# EAGLE design schematics (EAGLE 7.5.0)
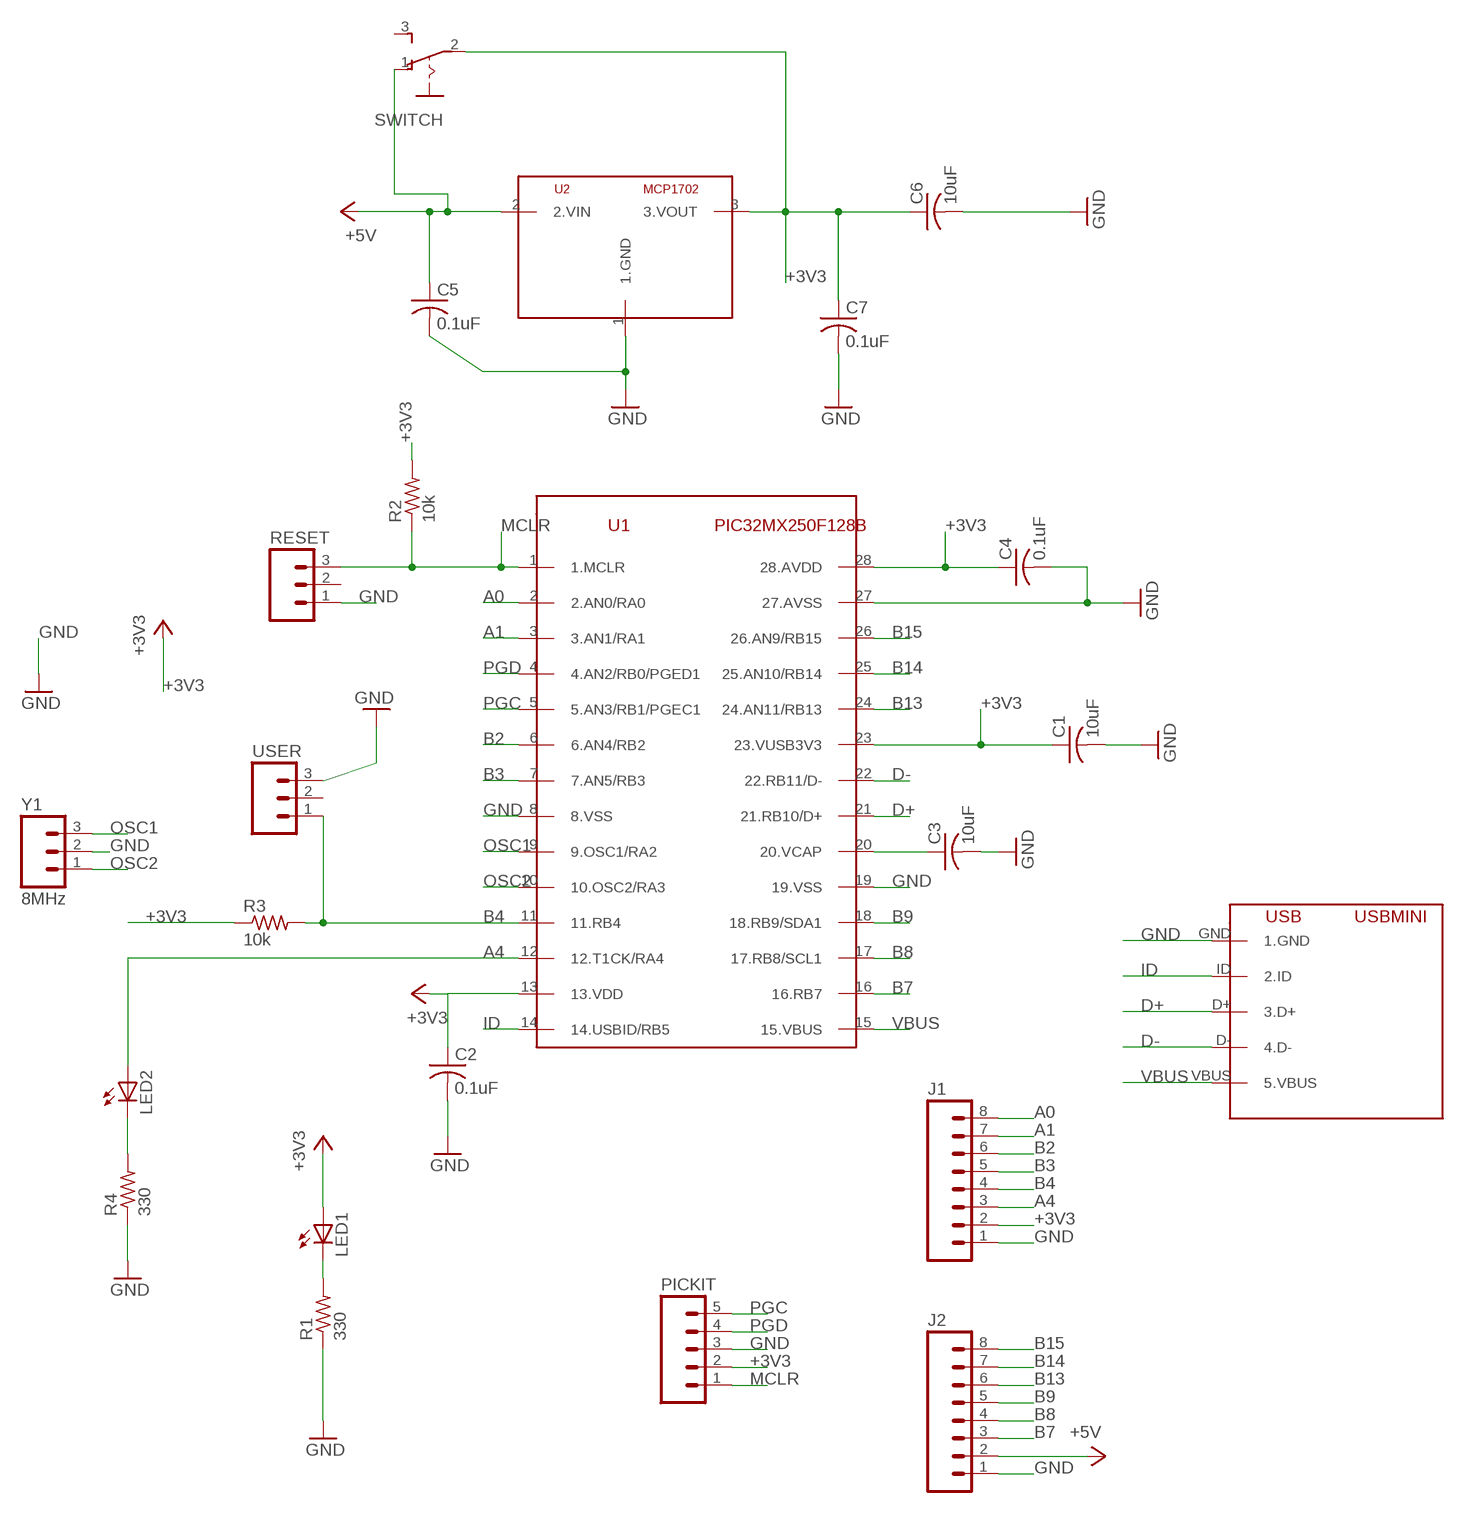
[diagram p0: schematic, sheet 1]

## Parts
C1  10uF  C-US025-024X044  [C025-024X044]
C2  0.1uF  C-US025-024X044  [C025-024X044]
C3  10uF  C-US025-024X044  [C025-024X044]
C4  0.1uF  C-US025-024X044  [C025-024X044]
C5  0.1uF  C-US025-024X044  [C025-024X044]
C6  10uF  C-US025-024X044  [C025-024X044]
C7  0.1uF  C-US025-024X044  [C025-024X044]
J1  M08  [1X08_ROUND]
J2  M08  [1X08_ROUND]
LED1  LED3MM  [LED3MM]
LED2  LED3MM  [LED3MM]
PICKIT  M05PTH  [1X05]
R1  330  R-US_0207/10  [0207/10]
R2  10k  R-US_0207/10  [0207/10]
R3  10k  R-US_0207/10  [0207/10]
R4  330  R-US_0207/10  [0207/10]
RESET  M03PTH  [1X03]
SWITCH  255SB  [255SB]
U1  PIC32MX250F128B  [DIL28-3]
U2  MCP1702  [TO92]
USB  USBMINI  [USB-MB-H]
USER  M03PTH  [1X03]
Y1  8MHz  M03PTH  [1X03]

## Nets
+3V3: C1.1 C2.1 C4.1 C6.1 C7.1 J1.2 LED1.A PICKIT.2 R2.2 R3.1 SWITCH.2(P) U1.13(13.VDD) U1.23(23.VUSB3V3) U1.28(28.AVDD) U2.3(3.VOUT)
+5V: C5.1 J2.2 SWITCH.1(O) U2.2(2.VIN)
A0: J1.8 U1.2(2.AN0/RA0)
A1: J1.7 U1.3(3.AN1/RA1)
A4: J1.3 LED2.A U1.12(12.T1CK/RA4)
B2: J1.6 U1.6(6.AN4/RB2)
B3: J1.5 U1.7(7.AN5/RB3)
B4: J1.4 R3.2 U1.11(11.RB4) USER.1
B7: J2.3 U1.16(16.RB7)
B8: J2.4 U1.17(17.RB8/SCL1)
B9: J2.5 U1.18(18.RB9/SDA1)
B13: J2.6 U1.24(24.AN11/RB13)
B14: J2.7 U1.25(25.AN10/RB14)
B15: J2.8 U1.26(26.AN9/RB15)
D+: U1.21(21.RB10/D+) USB.D+(3.D+)
D-: U1.22(22.RB11/D-) USB.D-(4.D-)
GND: C1.2 C2.2 C3.2 C4.2 C5.2 C6.2 C7.2 J1.1 J2.1 PICKIT.3 R1.1 R4.1 RESET.1 U1.8(8.VSS) U1.19(19.VSS) U1.27(27.AVSS) U2.1(1.GND) USB.GND(1.GND) USER.3 Y1.2
ID: U1.14(14.USBID/RB5) USB.ID(2.ID)
MCLR: PICKIT.1 R2.1 RESET.3 U1.1(1.MCLR)
N$1: LED2.K(C) R4.2
N$2: LED1.K(C) R1.2
N$17: C3.1 U1.20(20.VCAP)
OSC1: U1.9(9.OSC1/RA2) Y1.3
OSC2: U1.10(10.OSC2/RA3) Y1.1
PGC: PICKIT.5 U1.5(5.AN3/RB1/PGEC1)
PGD: PICKIT.4 U1.4(4.AN2/RB0/PGED1)
VBUS: U1.15(15.VBUS) USB.VBUS(5.VBUS)
Unconnected: RESET.2 SWITCH.3(S) USER.2

## Library data of the parts
C1-C7 = libraries:C-US: CAPACITOR, American symbol
J1 J2 = libraries:M08: Header 8 Standard 8-pin 0.1" header. Use with straight break away headers (SKU : PRT-00116), right angle break away headers (PRT-00553), swiss pins (PRT-00743), machine pins (PRT-00117), and female headers (PRT-00115).; PROD_ID: CONN-08437
LED1 LED2 = led:LED: LED OSRAM: - CHIPLED LG R971, LG N971, LY N971, LG Q971, LY Q971, LO R971, LY R971 LH N974, LH R974 LS Q976, LO Q976, LY Q976 LO Q996 - Hyper CHIPLED LW Q18S LB Q993, LB Q99A, LB R99A - SideLED LS A670, LO A670, LY A670, LG A670, LP A670 LB A673, LV A673, LT A673, LW A673 LH A674 LY A675 LS A676, LA A676, LO A676, LY A676, LW A676 LS A679, LY A679, LG A679 - Hyper Micro SIDELED® LS Y876, LA Y876, LO Y876, LY Y876 LT Y87S - SmartLED LW L88C, LW L88S LB L89C, LB L89S, LG L890 LS L89K, LO L89K, LY L89K LS L896, LA L896, LO L896, LY L896 - TOPLED LS T670, LO T670, LY T670, LG T670, LP T670 LSG T670, LSP T670, LSY T670, LOP T670, LYG T670 LG T671, LOG T671, LSG T671 LB T673, LV T673, LT T673, LW T673 LH T674 LS T676, LA T676, LO T676, LY T676, LB T676, LH T676, LSB T676, LW T676 LB T67C, LV T67C, LT T67C, LS T67K, LO T67K, LY T67K, LW E67C LS E67B, LA E67B, LO E67B, LY E67B, LB E67C, LV E67C, LT E67C LW T67C LS T679, LY T679, LG T679 LS T770, LO T770, LY T770, LG T770, LP T770 LB T773, LV T773, LT T773, LW T773 LH T774 LS E675, LA E675, LY E675, LS T675 LS T776, LA T776, LO T776, LY T776, LB T776 LHGB T686 LT T68C, LB T68C - Hyper Mini TOPLED® LB M676 - Mini TOPLED Santana® LG M470 LS M47K, LO M47K, LY M47K Source: http://www.osram.convergy.de LUXEON: - LUMILED® LXK2-PW12-R00, LXK2-PW12-S00, LXK2-PW14-U00, LXK2-PW14-V00 LXK2-PM12-R00, LXK2-PM12-S00, LXK2-PM14-U00 LXK2-PE12-Q00, LXK2-PE12-R00, LXK2-PE12-S00, LXK2-PE14-T00, LXK2-PE14-U00 LXK2-PB12-K00, LXK2-PB12-L00, LXK2-PB12-M00, LXK2-PB14-N00, LXK2-PB14-P00, LXK2-PB14-Q00 LXK2-PR12-L00, LXK2-PR12-M00, LXK2-PR14-Q00, LXK2-PR14-R00 LXK2-PD12-Q00, LXK2-PD12-R00, LXK2-PD12-S00 LXK2-PH12-R00, LXK2-PH12-S00 LXK2-PL12-P00, LXK2-PL12-Q00, LXK2-PL12-R00 Source: www.luxeon.com KINGBRIGHT: KA-3528ASYC Source: www.kingbright.com
PICKIT = libraries:M05: Header 5 Standard 5-pin 0.1" header. Use with straight break away headers (SKU : PRT-00116), right angle break away headers (PRT-00553), swiss pins (PRT-00743), machine pins (PRT-00117), and female headers (PRT-00115). Molex polarized connector foot print use with SKU : PRT-08230 with associated crimp pins and housings.
R1 R4 = resistor:R-US_: RESISTOR, American symbol
R2 R3 = libraries:R-US_: RESISTOR, American symbol
RESET USER Y1 = libraries:M03: Header 3 Standard 3-pin 0.1" header. Use with straight break away headers (SKU : PRT-00116), right angle break away headers (PRT-00553), swiss pins (PRT-00743), machine pins (PRT-00117), and female headers (PRT-00115). Molex polarized connector foot print use with SKU : PRT-08232 with associated crimp pins and housings.
SWITCH = libraries:255SB: SLIDING SWITCH Distributor Buerklin, 11G810
U1 = libraries:PIC32MX250F128B
U2 = libraries:MCP1702
USB = libraries:USBMINI

## Board
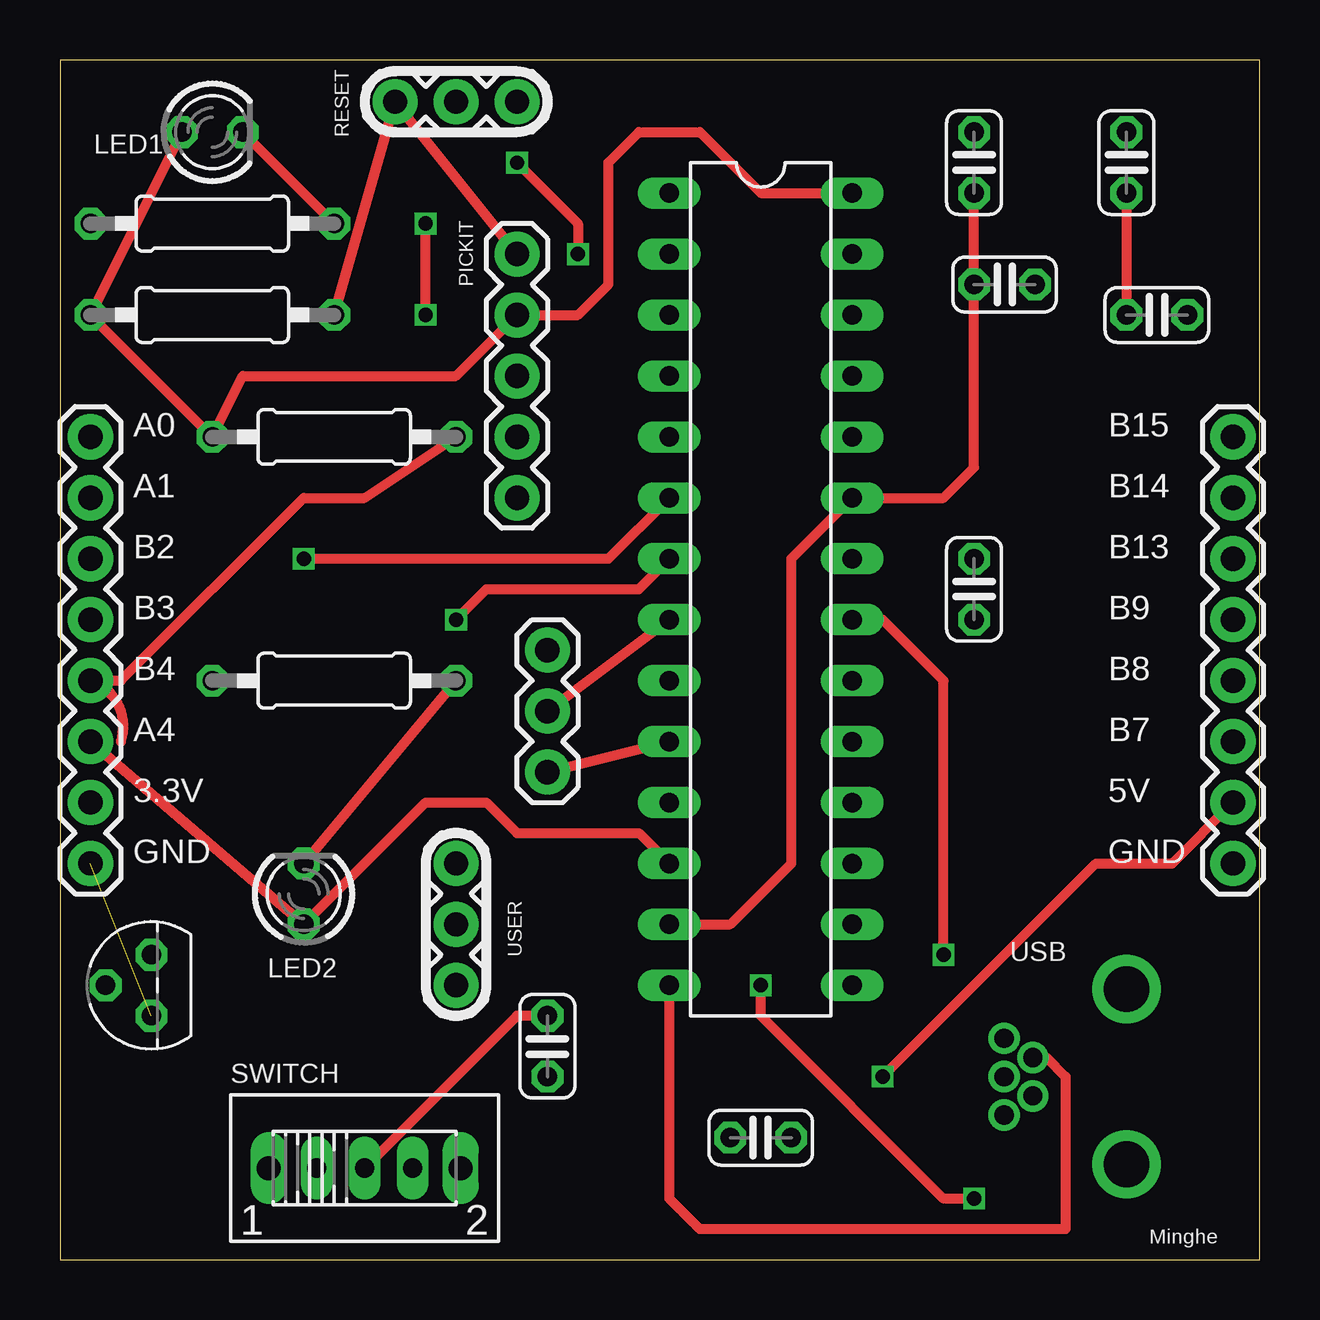
[diagram p1: board, top side]
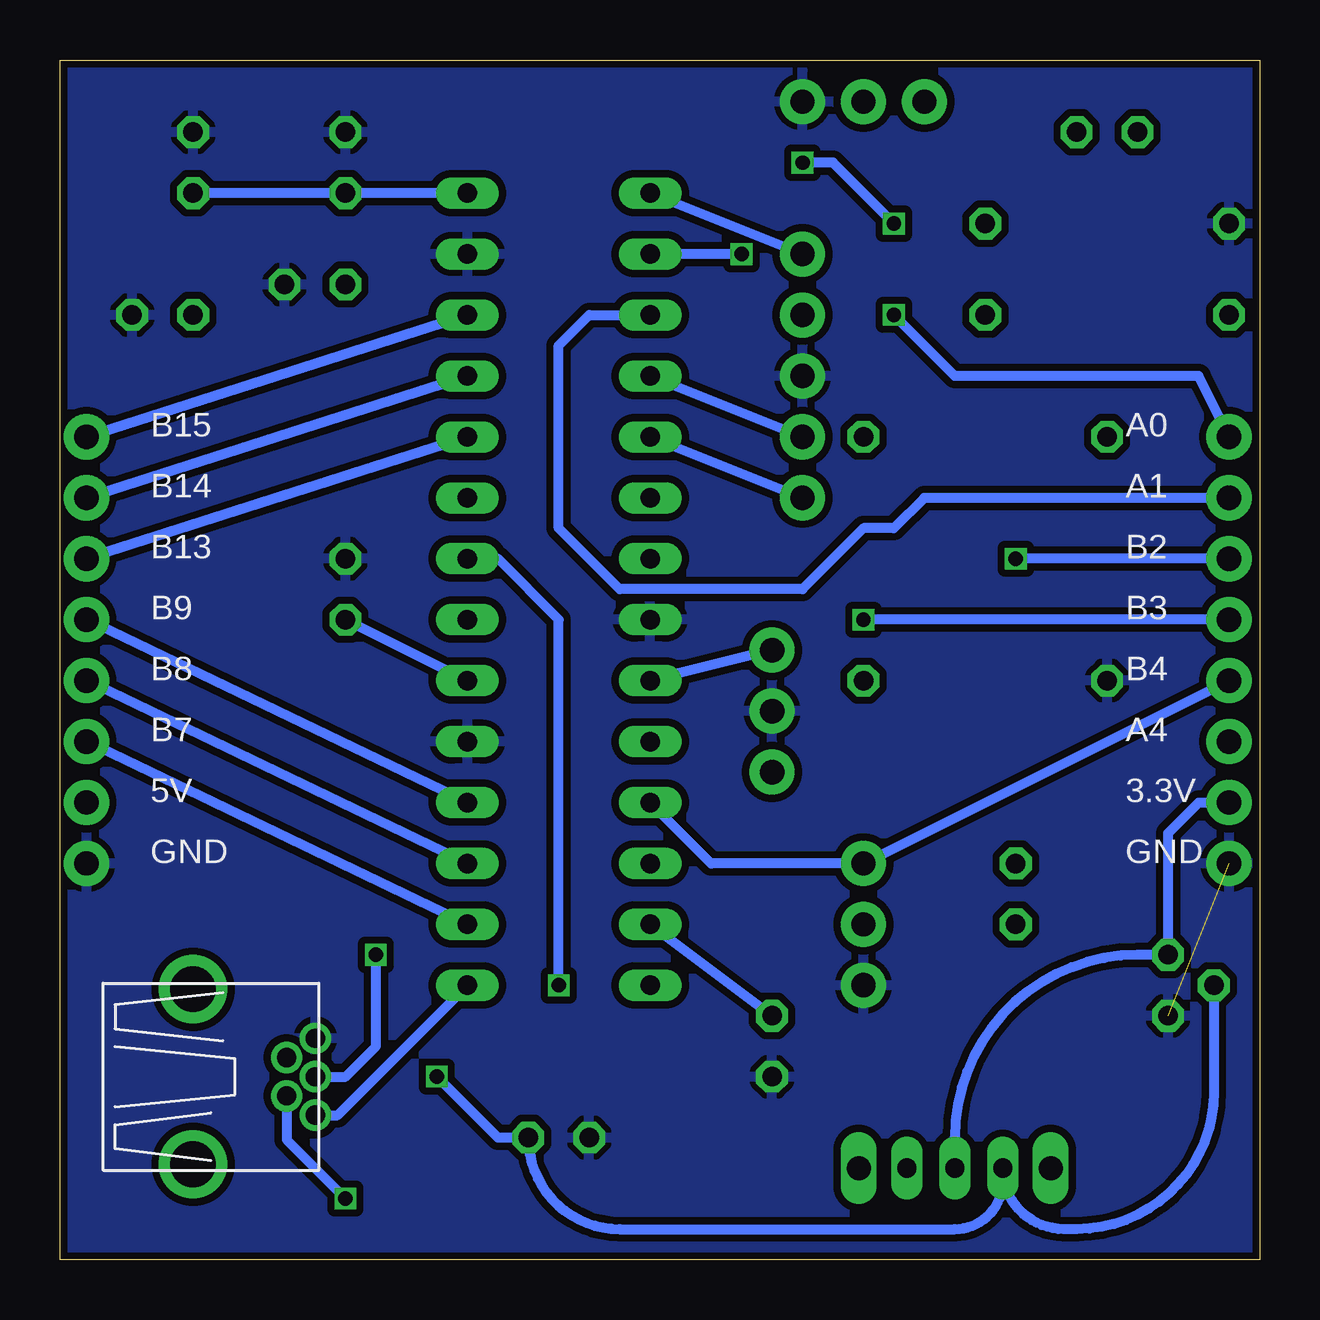
[diagram p2: board, bottom side, seen from below]

Size 50 x 50 mm. Coordinates in mm from the lower left corner, seen from the top.
Outline: 0,0 50,0 50,50 0,50 0,0
Copper layers (1*16): Top 0.035mm / dielectric 1.5mm / Bottom 0.035mm
Design rules "SeeedStudio_2layer_DRU_no_angle_20140221": minimum track width 6mil, minimum drill 12mil, track to track 6mil, track to pad 6mil, pad to pad 6mil, via to via 6mil, smd to smd 0mil, copper to edge 10mil, drill to drill 10mil, minimum pad ring 10mil, minimum via ring 6mil, stop-mask expansion 2mil, vias tented up to drill 100mil, thermal gap 10mil

### Footprints (pad centres in the part's own frame; a part is rotated, then mirrored left to right if it is on the bottom)
C025-024X044 = drill 0.813 octagon: 1 -1.27,0; 2 1.27,0
1X08_ROUND = drill 1.016 pad 1.88: 1 0,0; 2 2.54,0; 3 5.08,0; 4 7.62,0; 5 10.16,0; 6 12.7,0; 7 15.24,0; 8 17.78,0
LED3MM = drill 0.813 octagon: A -1.27,0; K 1.27,0
1X05 = drill 1.016 pad 1.88: 1 0,0; 2 2.54,0; 3 5.08,0; 4 7.62,0; 5 10.16,0
0207/10 = drill 0.813 octagon: 1 -5.08,0; 2 5.08,0
1X03 = drill 1.016 pad 1.88: 1 0,0; 2 2.54,0; 3 5.08,0
255SB = drill 0.8 long: 1 -2,0; 2 0,0; 3 2,0 | drill 1 long: P$1 -4,0; P$2 4,0
DIL28-3 = drill 0.813 long: 1 -16.51,-3.81; 2 -13.97,-3.81; 3 -11.43,-3.81; 4 -8.89,-3.81; 5 -6.35,-3.81; 6 -3.81,-3.81; 7 -1.27,-3.81; 8 1.27,-3.81; 9 3.81,-3.81; 10 6.35,-3.81; 11 8.89,-3.81; 12 11.43,-3.81; 13 13.97,-3.81; 14 16.51,-3.81; 15 16.51,3.81; 16 13.97,3.81; 17 11.43,3.81; 18 8.89,3.81; 19 6.35,3.81; 20 3.81,3.81; 21 1.27,3.81; 22 -1.27,3.81; 23 -3.81,3.81; 24 -6.35,3.81; 25 -8.89,3.81; 26 -11.43,3.81; 27 -13.97,3.81; 28 -16.51,3.81
TO92 = drill 0.813 octagon: 1 -1.27,0; 2 0,1.905; 3 1.27,0
USB-MB-H = drill 0.8: D+ 5.1,0; D- 3.9,0.8; GND 5.1,-1.6; ID 3.9,-0.8; VBUS 5.1,1.6 | drill 1.9: P$6 0,-3.65; P$7 0,3.65

### Placement (x,y rotation side)
C1  38.1,45.72 90 top
C2  39.37,40.64 0 top
C3  38.1,27.94 90 top
C4  45.72,39.37 0 top
C5  29.21,5.08 180 top
C6  20.32,8.89 270 top
C7  44.45,45.72 90 top
J1  1.27,16.51 90 top
J2  48.9,16.51 90 top
LED1  6.35,46.99 0 top
LED2  10.16,15.24 90 top
PICKIT  19.05,41.91 270 top
R1  6.35,43.18 0 top
R2  6.35,39.37 180 top
R3  11.43,34.29 0 top
R4  11.43,24.13 0 top
RESET  19.05,48.26 180 top
SWITCH  12.7,3.81 0 top
U1  29.21,27.94 270 top
U2  3.81,11.43 90 top
USB  44.45,7.62 180 top
USER  16.51,16.51 270 top
Y1  20.32,20.32 90 top

### Tracks (layer width: path | path; a pad name or v marks a point on that pad's centre or on a via)
+3V3
  Top 0.406: LED1.A R2.2 R3.1 7.62,36.83 16.51,36.83 PICKIT.2 21.59,39.37 22.86,40.64 22.86,45.72 24.13,46.99 26.67,46.99 29.21,44.45 U1.28 | C7.1 C4.1 | C1.1 C2.1 38.1,33.02 36.83,31.75 U1.23 30.48,29.21 30.48,16.51 27.94,13.97 U1.13 | C6.1 19.05,10.16 SWITCH.2
  Bottom 0.406: C6.1 U1.13 | U1.28 C1.1 C7.1 | J1.2 2.54,19.05 3.81,17.78 U2.3 5.08,12.7 arc-90 12.7,5.08 SWITCH.2
+5V  (via drill 0.6)
  Top 0.406: v34.29,7.62 43.18,16.51 46.35,16.51 J2.2
  Bottom 0.406: U2.2 1.91,6.99 arc90 7.62,1.27 8.16,1.27 arc90 SWITCH.1 10.7,3.27 arc90 12.7,1.27 26.67,1.27 arc90 C5.1 31.75,5.08 v34.29,7.62
A0  (via drill 0.6)
  Top 0.406: v15.24,39.37 v15.24,43.18 | v19.05,45.72 21.59,43.18 v21.59,41.91
  Bottom 0.406: J1.8 2.54,36.83 12.7,36.83 v15.24,39.37 | v15.24,43.18 17.78,45.72 v19.05,45.72 | v21.59,41.91 U1.2
A1
  Bottom 0.406: U1.3 27.94,39.37 29.21,38.1 29.21,30.48 26.67,27.94 19.05,27.94 16.51,30.48 15.24,30.48 13.97,31.75 J1.7
A4
  Top 0.406: J1.3 LED2.A 15.24,19.05 17.78,19.05 19.05,17.78 24.13,17.78 U1.12
B2  (via drill 0.6)
  Top 0.406: v10.16,29.21 22.86,29.21 U1.6
  Bottom 0.406: J1.6 v10.16,29.21
B3  (via drill 0.6)
  Top 0.406: v16.51,26.67 17.78,27.94 24.13,27.94 U1.7
  Bottom 0.406: J1.5 v16.51,26.67
B4
  Top 0.406: 2.54,21.59 arc90 J1.4 2.54,24.13 10.16,31.75 12.7,31.75 R3.2
  Bottom 0.406: J1.4 USER.1 22.86,16.51 U1.11
B7
  Bottom 0.406: U1.16 J2.3
B8
  Bottom 0.406: U1.17 J2.4
B9
  Bottom 0.406: U1.18 J2.5
B13
  Bottom 0.406: U1.24 J2.6
B14
  Bottom 0.406: U1.25 J2.7
B15
  Bottom 0.406: U1.26 J2.8
D+  (via drill 0.6)
  Top 0.406: v36.83,12.7 36.83,24.13 34.29,26.67 U1.21
  Bottom 0.406: USB.D+ 38.1,7.62 36.83,8.89 v36.83,12.7
D-  (via drill 0.6)
  Top 0.406: v38.1,2.54 36.83,2.54 29.21,10.16 v29.21,11.43
  Bottom 0.406: v29.21,11.43 29.21,26.67 31.75,29.21 U1.22 | USB.D- 40.55,4.99 v38.1,2.54
GND  (1 unrouted)
  Top 0.406: Y1.2 U1.8
  pour Bottom (isolate 0.305): 0,49.53 0,0 50.8,0 50.8,49.53 50.8,50.8 0,50.8
ID
  Top 0.406: USB.ID 41.11,8.42 41.91,7.62 41.91,1.27 26.67,1.27 25.4,2.54 U1.14
MCLR
  Top 0.406: R2.1 RESET.3 PICKIT.1
  Bottom 0.406: PICKIT.1 U1.1
N$1
  Top 0.406: R4.2 LED2.K
N$2
  Top 0.406: LED1.K R1.2
N$17
  Bottom 0.406: C3.1 U1.20
OSC1
  Bottom 0.406: Y1.3 U1.9
OSC2
  Top 0.406: Y1.1 U1.10
PGC
  Bottom 0.406: PICKIT.5 U1.5
PGD
  Bottom 0.406: PICKIT.4 U1.4
VBUS
  Bottom 0.406: USB.VBUS 38.43,6.02 U1.15

### Text on the board
tPlace: A0 | B15 | A1 | B14 | B2 | B13 | B3 | B9 | B4 | B8 | A4 | B7 | 3.3V | 5V | GND | GND | Minghe
bPlace: A0 | B15 | A1 | B14 | B2 | B13 | B3 | B9 | B4 | B8 | A4 | B7 | 3.3V | 5V | GND | GND